# Altium schematic sheet Sheet1.SchDoc
size A4
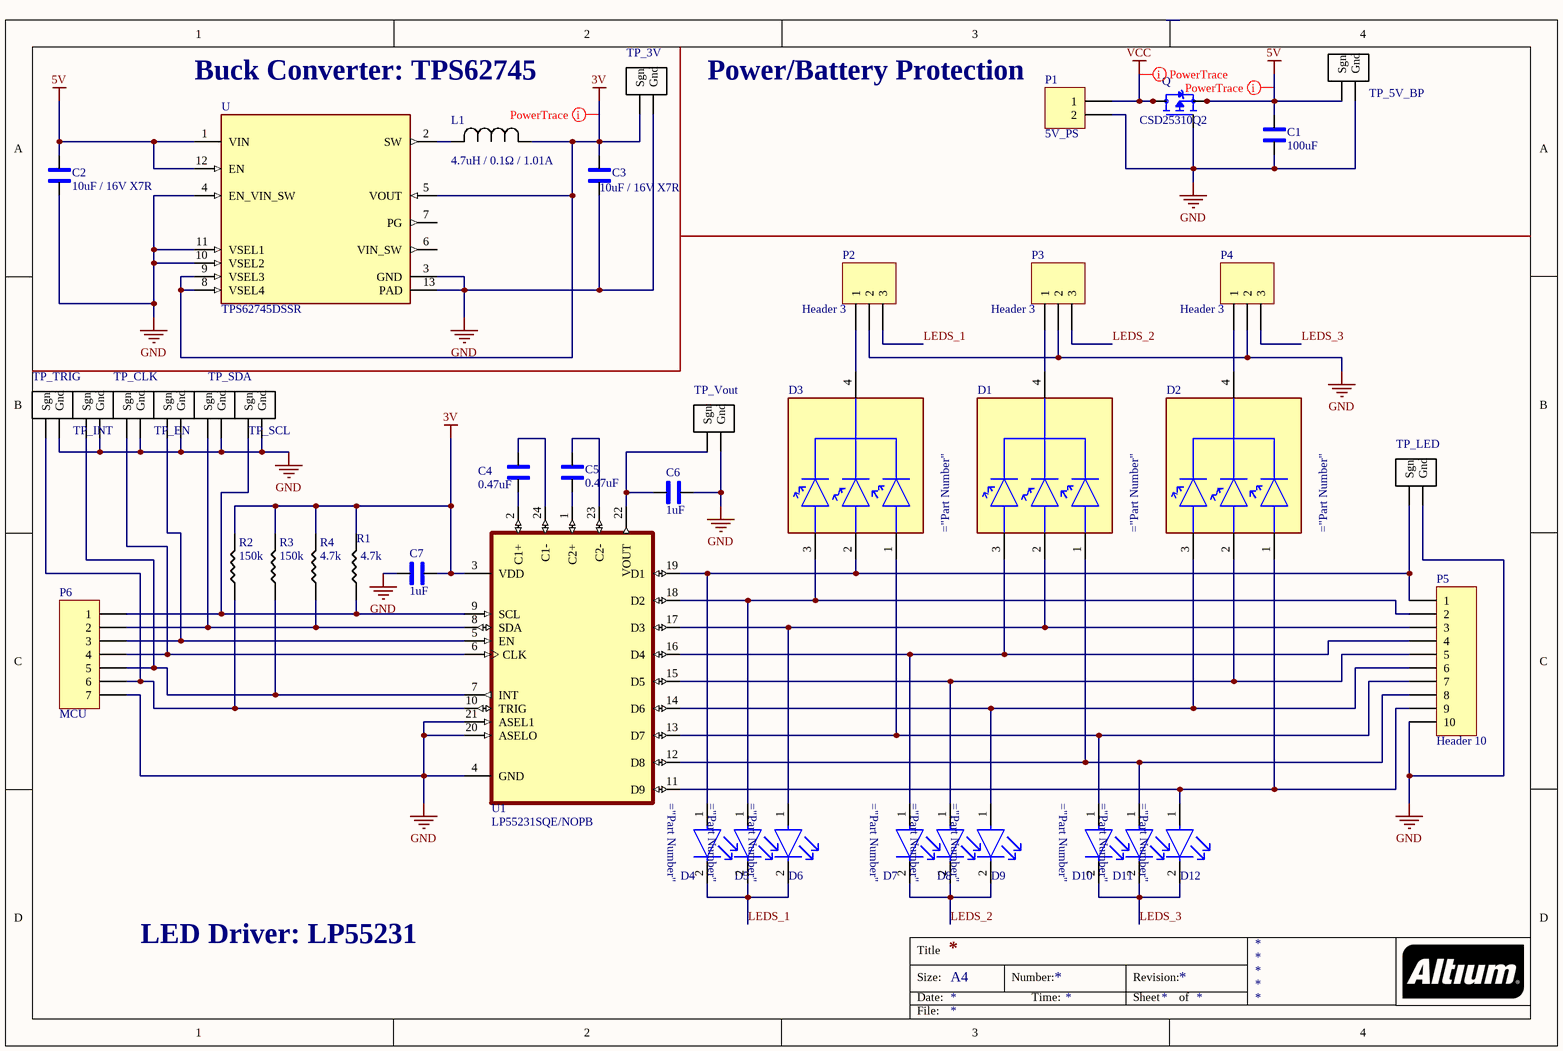
[diagram p0: Sheet1.SchDoc]

## Parts
C1  100uF  [1206_Passive]
C2  value 10uF / 16V X7R  [1206_Passive]  (hidden comment: 10uF)
C3  value 10uF / 16V X7R  [1206_Passive]  (hidden comment: 10uF)
C4  0.47uF  [1206_Passive]
C5  0.47uF  [1206_Passive]
C6  1uF  [1206_Passive]
C7  1uF  [1206_Passive]
D1  XZM2CRKM2DGFBB45SCCB  [SunLED_XZM2CRKM2DGFBB45SCCB_0]  (value not drawn)
D2  XZM2CRKM2DGFBB45SCCB  [SunLED_XZM2CRKM2DGFBB45SCCB_0]  (value not drawn)
D3  XZM2CRKM2DGFBB45SCCB  [SunLED_XZM2CRKM2DGFBB45SCCB_0]  (value not drawn)
D4  CLM3C-WKW-CWBYA453  [Cree_CLM3C-WKW_MFG]  (value not drawn)
D5  CLM3C-WKW-CWBYA453  [Cree_CLM3C-WKW_MFG]  (value not drawn)
D6  CLM3C-WKW-CWBYA453  [Cree_CLM3C-WKW_MFG]  (value not drawn)
D7  CLM3C-WKW-CWBYA453  [Cree_CLM3C-WKW_MFG]  (value not drawn)
D8  CLM3C-WKW-CWBYA453  [Cree_CLM3C-WKW_MFG]  (value not drawn)
D9  CLM3C-WKW-CWBYA453  [Cree_CLM3C-WKW_MFG]  (value not drawn)
D10  CLM3C-WKW-CWBYA453  [Cree_CLM3C-WKW_MFG]  (value not drawn)
D11  CLM3C-WKW-CWBYA453  [Cree_CLM3C-WKW_MFG]  (value not drawn)
D12  CLM3C-WKW-CWBYA453  [Cree_CLM3C-WKW_MFG]  (value not drawn)
L1  4.7uH / 0.1Ω / 1.01A  [IND_IHLP-3232DZ]
P1  5V_PS  [HDR1X2]
P2  Header 3  [HDR1X3]
P3  Header 3  [HDR1X3]
P4  Header 3  [HDR1X3]
P5  Header 10  [HDR1X10]
P6  MCU  [HDR1X7]
Q  CSD25310Q2  [TRANS_CSD25310Q2]
R1  value 4.7k  [1206_Passive]  (hidden comment: 100m)
R2  value 150k  [1206_Passive]  (hidden comment: 100m)
R3  value 150k  [1206_Passive]  (hidden comment: 100m)
R4  value 4.7k  [1206_Passive]  (hidden comment: 100m)
TP_3V  10x Probe TP  [TP10x_Probe]  (value not drawn)
TP_5V_BP  10x Probe TP  [TP10x_Probe]  (value not drawn)
TP_CLK  10x Probe TP  [TP10x_Probe]  (value not drawn)
TP_EN  10x Probe TP  [TP10x_Probe]  (value not drawn)
TP_INT  10x Probe TP  [TP10x_Probe]  (value not drawn)
TP_LED  10x Probe TP  [TP10x_Probe]  (value not drawn)
TP_SCL  10x Probe TP  [TP10x_Probe]  (value not drawn)
TP_SDA  10x Probe TP  [TP10x_Probe]  (value not drawn)
TP_TRIG  10x Probe TP  [TP10x_Probe]  (value not drawn)
TP_Vout  10x Probe TP  [TP10x_Probe]  (value not drawn)
U  TPS62745DSSR  [DSS0012A]
U1  LP55231SQE/NOPB  [QFN50P400X400X80-25N]

## Nets
3V: C3.2 C7.1 L1.1 R1.2 R2.2 R3.2 R4.2 TP_3V.1(Sgn) U.5(VOUT) U.8(VSEL4) U.9(VSEL3) U1.3(VDD)
5V: C1.2 C2.2 Q.1(S) Q.2(S) Q.5(S) Q.6(S) Q.7(S) TP_5V_BP.1(Sgn) U.1(VIN) U.12(EN)
GND: C1.1 C2.1 C3.1 C6.2 C7.2 P1.2 P2.2 P3.2 P4.2 P5.10 P6.7 Q.3(G) TP_3V.2(Gnd) TP_5V_BP.2(Gnd) TP_CLK.2(Gnd) TP_EN.2(Gnd) TP_INT.2(Gnd) TP_LED.2(Gnd) TP_SCL.2(Gnd) TP_SDA.2(Gnd) TP_TRIG.2(Gnd) TP_Vout.2(Gnd) U.3(GND) U.4(EN_VIN_SW) U.10(VSEL2) U.11(VSEL1) U.13(PAD) U1.4(GND) U1.20(ASELO) U1.21(ASEL1)
VCC: P1.1 Q.4(D) Q.8(D)
LEDS_1: D4.2(C) D5.2(C) D6.2(C) P2.3
LEDS_2: D7.2(C) D8.2(C) D9.2(C) P3.3
LEDS_3: D10.2(C) D11.2(C) D12.2(C) P4.3
NetC4_1: C4.1 U1.2(C1+)
NetC4_2: C4.2 U1.24(C1-)
NetC5_1: C5.1 U1.1(C2+)
NetC5_2: C5.2 U1.23(C2-)
NetC6_1: C6.1 TP_Vout.1(Sgn) U1.22(VOUT)
NetD1_1: D1.1(RED_A) D11.1(A) P5.8 U1.12(D8)
NetD1_2: D1.2(GREEN_A) D6.1(A) P5.3 U1.17(D3)
NetD1_3: D1.3(BLUE_A) D7.1(A) P5.4 U1.16(D4)
NetD1_4: D1.4(COMMON_CATHODE) P3.1
NetD2_1: D2.1(RED_A) D12.1(A) P5.9 U1.11(D9)
NetD2_2: D2.2(GREEN_A) D8.1(A) P5.5 U1.15(D5)
NetD2_3: D2.3(BLUE_A) D9.1(A) P5.6 U1.14(D6)
NetD2_4: D2.4(COMMON_CATHODE) P4.1
NetD3_1: D3.1(RED_A) D10.1(A) P5.7 U1.13(D7)
NetD3_2: D3.2(GREEN_A) D4.1(A) P5.1 TP_LED.1(Sgn) U1.19(D1)
NetD3_3: D3.3(BLUE_A) D5.1(A) P5.2 U1.18(D2)
NetD3_4: D3.4(COMMON_CATHODE) P2.1
NetL1_2: L1.2 U.2(SW)
NetP6_1: P6.1 R1.1 TP_SCL.1(Sgn) U1.9(SCL)
NetP6_2: P6.2 R4.1 TP_SDA.1(Sgn) U1.8(SDA)
NetP6_3: P6.3 TP_EN.1(Sgn) U1.5(EN)
NetP6_4: P6.4 TP_CLK.1(Sgn) U1.6(CLK)
NetP6_5: P6.5 R3.1 TP_INT.1(Sgn) U1.7(INT)
NetP6_6: P6.6 R2.1 TP_TRIG.1(Sgn) U1.10(TRIG)

Not connected (* = marked no-connect by the designer): U 6(VIN_SW) 7(PG)

## Layout directives
rule Width Constraint [Pref Width = 20mil    Min Width = 10mil    Max Width = 100mil]: 3V, 5V, VCC

## Notes on the sheet
- Buck Converter: TPS62745
- (near P1) Power/Battery Protection
- LED Driver: LP55231
- Title
- Size:
- Date:
- A4
- Number:
- Time:
- Revision:
- Sheet
- of
- File:

## Library data of the parts
C1 = C_1uF_1206: 100µF X5R 1206 (3216 Metric); MFR Part #: CL31B105KBHNNNE; Type: Basic; Digikey Link: https://www.digikey.com/product-detail/en/C1206C105M4RACTU/399-8150-1-ND/3471873/?itemSeq=304982366; Digikey Part: 399-8150-1-ND; LCSC Part#: C1848; Value: 100uF
C2 C3 = C_1uF_1206: 10µF ±20% 16V Ceramic Capacitor X7R 1206 (3216 Metric); MFR Part #: CL31B105KBHNNNE; Type: Basic; Digikey Link: https://www.digikey.com/product-detail/en/C1206C105M4RACTU/399-8150-1-ND/3471873/?itemSeq=304982366; Digikey Part: 399-8150-1-ND; LCSC Part#: C1848
C4 C5 = C_1uF_1206: 0.47µF ±20% 16V Ceramic Capacitor X7R 1206 (3216 Metric); MFR Part #: CL31B105KBHNNNE; Type: Basic; Digikey Link: https://www.digikey.com/product-detail/en/C1206C105M4RACTU/399-8150-1-ND/3471873/?itemSeq=304982366; Digikey Part: 399-8150-1-ND; LCSC Part#: C1848; Value: 0.47uF
C6 C7 = C_1uF_1206: 1µF ±20% 16V Ceramic Capacitor X7R 1206 (3216 Metric); MFR Part #: CL31B105KBHNNNE; Type: Basic; Digikey Link: https://www.digikey.com/product-detail/en/C1206C105M4RACTU/399-8150-1-ND/3471873/?itemSeq=304982366; Digikey Part: 399-8150-1-ND; LCSC Part#: C1848; Value: 1uF
L1 = L_5.6uH: 4.7uH / 0.1Ω / 1.01A; Manufacturer_Part_Number: IHLP3232DZER5R6M11; Vendor: VISHAY; Built_By: EMA_UL_Team; SourceLibrary: Vishay_2010-01-01_IND_IHLP; Type: DEV; Copyright: Copyright (C) 2018 Accelerated Designs. All rights reserved; RefDes: RefDes
P1 = Header 2: Header, 2-Pin; LatestRevisionDate: 17-Jul-2002; LatestRevisionNote: Re-released for DXP Platform.; Publisher: Altium Limited
P2-P4 = Header 3: Header, 3-Pin; LatestRevisionDate: 17-Jul-2002; LatestRevisionNote: Re-released for DXP Platform.; Publisher: Altium Limited
P5 = Header 10: Header, 10-Pin; LatestRevisionDate: 17-Jul-2002; LatestRevisionNote: Re-released for DXP Platform.; Publisher: Altium Limited
P6 = Header 7: Header, 7-Pin; LatestRevisionDate: 17-Jul-2002; LatestRevisionNote: Re-released for DXP Platform.; Publisher: Altium Limited
Q = CSD25310Q2: P-Channel 20V 20A _Ta_ 2.9W _Ta_ Surface Mount 6-WSON _2x2_; MF: Texas Instruments; SnapEDA_Link: https://www.snapeda.com/parts/CSD25310Q2/Texas%20Instruments/view-part/479796/?ref=snap; Availability: Unavailable; Price: None; Package: WDFN-6 Texas Instruments; MP: CSD25310Q2; Value: *
R1-R4 = R_100m_1206: 100 mOhms ±1% 0.5W, 1/2W Chip Resistor 1206 (3216 Metric) Anti-Sulfur, Moisture Resistant Thin Film; Digikey Link: https://www.digikey.com/product-detail/en/RNCP1206FTD1K00/RNCP1206FTD1K00CT-ND/2240675/?itemSeq=304982373; Digikey Part: RNCP1206FTD1K00CT-ND
TP_3V TP_5V_BP TP_CLK TP_EN TP_INT TP_LED TP_SCL TP_SDA TP_TRIG TP_Vout = TP_10x_Probe: Test Point 300 mil centers
U = TPS62745DSSR: 3.3V-10V input, 300mA Ultra Low Iq step-down converter with VSEL and input voltage switch 12-WSON -40 to 125; MF: Texas Instruments; SnapEDA_Link: https://www.snapeda.com/parts/TPS62745DSSR/Texas%20Instruments/view-part/229862/?ref=snap; Price: None; MP: TPS62745DSSR; Availability: Unavailable; Value: *; Texas_Instruments-Purchase-URL: https://snapeda.com/shop?store=Texas+Instruments&id=229862; Package: WSON-12 Texas Instruments
U1 = LP55231SQE/NOPB: 9 channel RGB / White LED driver with internal program memory and integrated charge Pump - WQFN 24-WQFN -30 to 85; MF: Texas Instruments; Availability: Warning; Purchase-URL: https://pricing.snapeda.com/search/part/LP55231SQE/NOPB/?ref=eda; SnapEDA_Link: https://www.snapeda.com/parts/LP55231SQE/NOPB/Texas%20Instruments/view-part/474412/?ref=snap; MP: LP55231SQE/NOPB; Price: None; Package: WQFN-24 Texas Instruments; Value: *